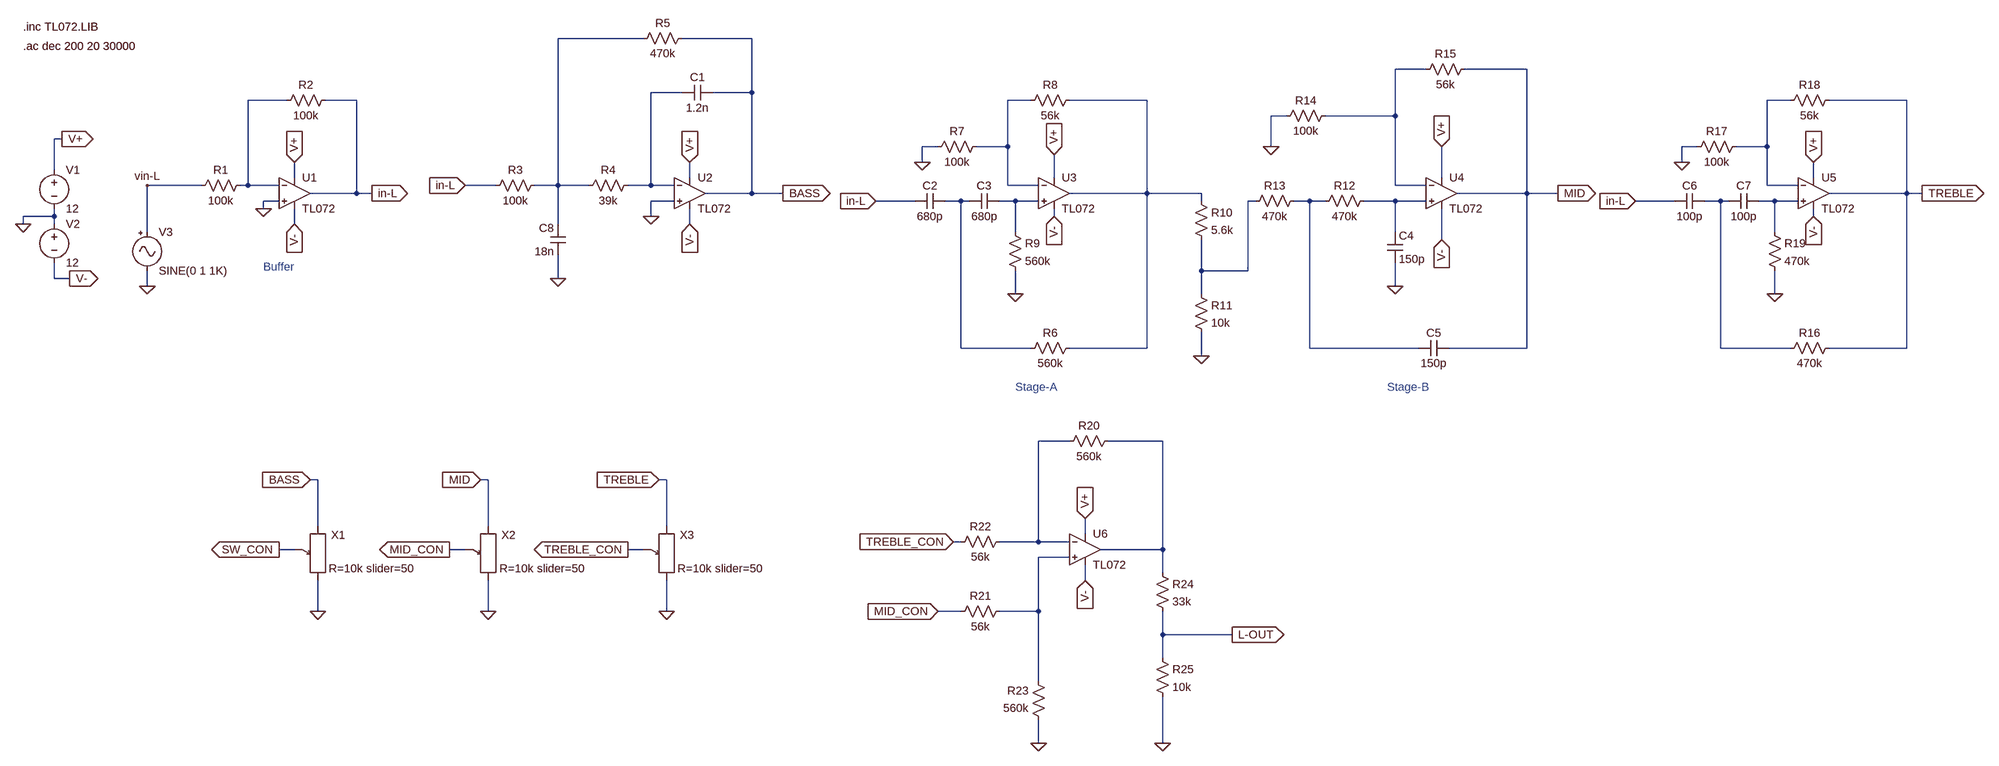
[diagram p0: schematic Audio-Preamplifier-LTSpice.asc]
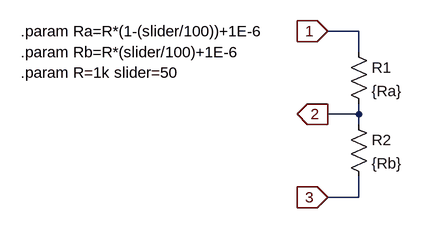
[diagram p1: sub-circuit potentiometer.asc]
Audio-Preamplifier-LTSpice.asc, the LTspice schematic file:
Version 4
SHEET 1 3604 1364
WIRE 816 -160 640 -160
WIRE 1040 -160 896 -160
WIRE 2432 -96 2368 -96
WIRE 2640 -96 2512 -96
WIRE 896 -48 832 -48
WIRE 1040 -48 1040 -160
WIRE 1040 -48 960 -48
WIRE 80 -32 0 -32
WIRE 224 -32 160 -32
WIRE 1616 -32 1568 -32
WIRE 1856 -32 1696 -32
WIRE 3184 -32 3136 -32
WIRE 3424 -32 3264 -32
WIRE 2144 0 2112 0
WIRE 2368 0 2368 -96
WIRE 2368 0 2224 0
WIRE -384 48 -400 48
WIRE 1424 64 1392 64
WIRE 1568 64 1568 -32
WIRE 1568 64 1504 64
WIRE 2112 64 2112 0
WIRE 2992 64 2960 64
WIRE 3136 64 3136 -32
WIRE 3136 64 3072 64
WIRE 1392 96 1392 64
WIRE 2960 96 2960 64
WIRE -400 112 -400 48
WIRE 96 128 96 96
WIRE 912 128 912 96
WIRE 1664 128 1664 80
WIRE 2464 128 2464 64
WIRE 3232 128 3232 96
WIRE -96 144 -208 144
WIRE 0 144 0 -32
WIRE 0 144 -16 144
WIRE 64 144 0 144
WIRE 512 144 448 144
WIRE 640 144 640 -160
WIRE 640 144 592 144
WIRE 704 144 640 144
WIRE 832 144 832 -48
WIRE 832 144 784 144
WIRE 880 144 832 144
WIRE 1568 144 1568 64
WIRE 1632 144 1568 144
WIRE 2368 144 2368 0
WIRE 2432 144 2368 144
WIRE 3136 144 3136 64
WIRE 3200 144 3136 144
WIRE 224 160 224 -32
WIRE 224 160 128 160
WIRE 256 160 224 160
WIRE 1040 160 1040 -48
WIRE 1040 160 944 160
WIRE 1104 160 1040 160
WIRE 1856 160 1856 -32
WIRE 1856 160 1696 160
WIRE 1968 160 1856 160
WIRE 2640 160 2640 -96
WIRE 2640 160 2496 160
WIRE 2704 160 2640 160
WIRE 3424 160 3424 -32
WIRE 3424 160 3264 160
WIRE 3456 160 3424 160
WIRE 64 176 32 176
WIRE 880 176 832 176
WIRE 1376 176 1296 176
WIRE 1472 176 1440 176
WIRE 1488 176 1472 176
WIRE 1584 176 1552 176
WIRE 1632 176 1584 176
WIRE 1968 176 1968 160
WIRE 2080 176 2064 176
WIRE 2192 176 2160 176
WIRE 2224 176 2192 176
WIRE 2368 176 2304 176
WIRE 2432 176 2368 176
WIRE 2944 176 2864 176
WIRE 3040 176 3008 176
WIRE 3056 176 3040 176
WIRE 3152 176 3120 176
WIRE 3200 176 3152 176
WIRE 32 192 32 176
WIRE -400 208 -400 192
WIRE -400 208 -464 208
WIRE 832 208 832 176
WIRE 1664 208 1664 192
WIRE 3232 208 3232 192
WIRE -464 224 -464 208
WIRE -400 224 -400 208
WIRE 96 224 96 192
WIRE 640 224 640 144
WIRE 912 224 912 192
WIRE -208 240 -208 144
WIRE 1584 240 1584 176
WIRE 2368 240 2368 176
WIRE 3152 240 3152 176
WIRE 2464 256 2464 192
WIRE 1968 320 1968 256
WIRE 2064 320 2064 176
WIRE 2064 320 1968 320
WIRE -400 336 -400 304
WIRE -368 336 -400 336
WIRE 640 336 640 288
WIRE -208 352 -208 320
WIRE 2368 352 2368 304
WIRE 1584 368 1584 320
WIRE 1968 368 1968 320
WIRE 3152 368 3152 320
WIRE 1472 480 1472 176
WIRE 1616 480 1472 480
WIRE 1856 480 1856 160
WIRE 1856 480 1696 480
WIRE 2192 480 2192 176
WIRE 2416 480 2192 480
WIRE 2640 480 2640 160
WIRE 2640 480 2480 480
WIRE 3040 480 3040 176
WIRE 3184 480 3040 480
WIRE 3424 480 3424 160
WIRE 3424 480 3264 480
WIRE 1968 496 1968 448
WIRE 1696 672 1632 672
WIRE 1888 672 1776 672
WIRE 144 752 128 752
WIRE 496 752 480 752
WIRE 864 752 848 752
WIRE 144 848 144 752
WIRE 496 848 496 752
WIRE 864 848 864 752
WIRE 1728 864 1728 832
WIRE 1472 880 1456 880
WIRE 1632 880 1632 672
WIRE 1632 880 1552 880
WIRE 1696 880 1632 880
WIRE 96 896 64 896
WIRE 448 896 416 896
WIRE 816 896 784 896
WIRE 1888 896 1888 672
WIRE 1888 896 1760 896
WIRE 1696 912 1632 912
WIRE 1888 944 1888 896
WIRE 1728 960 1728 928
WIRE 144 1024 144 960
WIRE 496 1024 496 960
WIRE 864 1024 864 960
WIRE 1472 1024 1424 1024
WIRE 1632 1024 1632 912
WIRE 1632 1024 1552 1024
WIRE 1888 1072 1888 1024
WIRE 2032 1072 1888 1072
WIRE 1888 1120 1888 1072
WIRE 1632 1168 1632 1024
WIRE 1632 1296 1632 1248
WIRE 1888 1296 1888 1200
FLAG -464 224 0
FLAG -384 48 V+
IOPIN -384 48 Out
FLAG -368 336 V-
IOPIN -368 336 Out
FLAG 32 192 0
FLAG -208 352 0
FLAG -208 144 vin-L
FLAG 256 160 in-L
IOPIN 256 160 Out
FLAG 832 208 0
FLAG 448 144 in-L
IOPIN 448 144 In
FLAG 2464 64 V+
IOPIN 2464 64 In
FLAG 2464 256 V-
IOPIN 2464 256 In
FLAG 1664 208 V-
IOPIN 1664 208 In
FLAG 1392 96 0
FLAG 1584 368 0
FLAG 1968 496 0
FLAG 2368 352 0
FLAG 2112 64 0
FLAG 1104 160 BASS
IOPIN 1104 160 Out
FLAG 2704 160 MID
IOPIN 2704 160 Out
FLAG 3232 208 V-
IOPIN 3232 208 In
FLAG 2960 96 0
FLAG 3152 368 0
FLAG 3456 160 TREBLE
IOPIN 3456 160 Out
FLAG 1664 80 V+
IOPIN 1664 80 In
FLAG 912 96 V+
IOPIN 912 96 In
FLAG 96 96 V+
IOPIN 96 96 In
FLAG 912 224 V-
IOPIN 912 224 In
FLAG 96 224 V-
IOPIN 96 224 In
FLAG 3232 96 V+
IOPIN 3232 96 In
FLAG 1728 832 V+
IOPIN 1728 832 In
FLAG 1728 960 V-
IOPIN 1728 960 In
FLAG 1632 1296 0
FLAG 128 752 BASS
IOPIN 128 752 In
FLAG 480 752 MID
IOPIN 480 752 In
FLAG 848 752 TREBLE
IOPIN 848 752 In
FLAG 144 1024 0
FLAG 496 1024 0
FLAG 864 1024 0
FLAG 64 896 SW_CON
IOPIN 64 896 Out
FLAG 416 896 MID_CON
IOPIN 416 896 Out
FLAG 784 896 TREBLE_CON
IOPIN 784 896 Out
FLAG 1456 880 TREBLE_CON
IOPIN 1456 880 In
FLAG 1424 1024 MID_CON
IOPIN 1424 1024 In
FLAG 2032 1072 L-OUT
IOPIN 2032 1072 Out
FLAG 1888 1296 0
FLAG 640 336 0
FLAG 1296 176 in-L
IOPIN 1296 176 In
FLAG 2864 176 in-L
IOPIN 2864 176 In
SYMBOL OpAmps\\opamp2 96 96 R0
SYMATTR InstName U1
SYMATTR Value TL072
SYMBOL voltage -400 96 R0
WINDOW 123 0 0 Left 0
WINDOW 39 0 0 Left 0
SYMATTR InstName V1
SYMATTR Value 12
SYMBOL voltage -400 208 R0
WINDOW 123 0 0 Left 0
WINDOW 39 0 0 Left 0
SYMATTR InstName V2
SYMATTR Value 12
SYMBOL res 0 128 R90
WINDOW 0 0 56 VBottom 2
WINDOW 3 32 56 VTop 2
SYMATTR InstName R1
SYMATTR Value 100k
SYMBOL res 176 -48 R90
WINDOW 0 0 56 VBottom 2
WINDOW 3 32 56 VTop 2
SYMATTR InstName R2
SYMATTR Value 100k
SYMBOL Misc\\signal -208 224 R0
WINDOW 39 0 0 Left 0
SYMATTR InstName V3
SYMATTR Value2 AC 1 0
SYMBOL OpAmps\\opamp2 912 96 R0
SYMATTR InstName U2
SYMATTR Value TL072
SYMBOL res 608 128 R90
WINDOW 0 0 56 VBottom 2
WINDOW 3 32 56 VTop 2
SYMATTR InstName R3
SYMATTR Value 100k
SYMBOL res 800 128 R90
WINDOW 0 0 56 VBottom 2
WINDOW 3 32 56 VTop 2
SYMATTR InstName R4
SYMATTR Value 39k
SYMBOL res 912 -176 R90
WINDOW 0 0 56 VBottom 2
WINDOW 3 32 56 VTop 2
SYMATTR InstName R5
SYMATTR Value 470k
SYMBOL cap 960 -64 R90
WINDOW 0 0 32 VBottom 2
WINDOW 3 32 32 VTop 2
SYMATTR InstName C1
SYMATTR Value 1.2n
SYMBOL OpAmps\\opamp2 1664 96 R0
SYMATTR InstName U3
SYMATTR Value TL072
SYMBOL OpAmps\\opamp2 2464 96 R0
SYMATTR InstName U4
SYMATTR Value TL072
SYMBOL cap 1440 160 R90
WINDOW 0 0 32 VBottom 2
WINDOW 3 32 32 VTop 2
SYMATTR InstName C2
SYMATTR Value 680p
SYMBOL cap 1552 160 R90
WINDOW 0 0 32 VBottom 2
WINDOW 3 32 32 VTop 2
SYMATTR InstName C3
SYMATTR Value 680p
SYMBOL res 1712 464 R90
WINDOW 0 0 56 VBottom 2
WINDOW 3 32 56 VTop 2
SYMATTR InstName R6
SYMATTR Value 560k
SYMBOL res 1520 48 R90
WINDOW 0 0 56 VBottom 2
WINDOW 3 32 56 VTop 2
SYMATTR InstName R7
SYMATTR Value 100k
SYMBOL res 1712 -48 R90
WINDOW 0 0 56 VBottom 2
WINDOW 3 32 56 VTop 2
SYMATTR InstName R8
SYMATTR Value 56k
SYMBOL res 1568 224 R0
SYMATTR InstName R9
SYMATTR Value 560k
SYMBOL res 1952 160 R0
SYMATTR InstName R10
SYMATTR Value 5.6k
SYMBOL res 1952 352 R0
SYMATTR InstName R11
SYMATTR Value 10k
SYMBOL res 2320 160 R90
WINDOW 0 0 56 VBottom 2
WINDOW 3 32 56 VTop 2
SYMATTR InstName R12
SYMATTR Value 470k
SYMBOL res 2176 160 R90
WINDOW 0 0 56 VBottom 2
WINDOW 3 32 56 VTop 2
SYMATTR InstName R13
SYMATTR Value 470k
SYMBOL res 2240 -16 R90
WINDOW 0 0 56 VBottom 2
WINDOW 3 32 56 VTop 2
SYMATTR InstName R14
SYMATTR Value 100k
SYMBOL res 2528 -112 R90
WINDOW 0 0 56 VBottom 2
WINDOW 3 32 56 VTop 2
SYMATTR InstName R15
SYMATTR Value 56k
SYMBOL cap 2352 240 R0
SYMATTR InstName C4
SYMATTR Value 150p
SYMBOL cap 2480 464 R90
WINDOW 0 0 32 VBottom 2
WINDOW 3 32 32 VTop 2
SYMATTR InstName C5
SYMATTR Value 150p
SYMBOL OpAmps\\opamp2 3232 96 R0
SYMATTR InstName U5
SYMATTR Value TL072
SYMBOL cap 3008 160 R90
WINDOW 0 0 32 VBottom 2
WINDOW 3 32 32 VTop 2
SYMATTR InstName C6
SYMATTR Value 100p
SYMBOL cap 3120 160 R90
WINDOW 0 0 32 VBottom 2
WINDOW 3 32 32 VTop 2
SYMATTR InstName C7
SYMATTR Value 100p
SYMBOL res 3280 464 R90
WINDOW 0 0 56 VBottom 2
WINDOW 3 32 56 VTop 2
SYMATTR InstName R16
SYMATTR Value 470k
SYMBOL res 3088 48 R90
WINDOW 0 0 56 VBottom 2
WINDOW 3 32 56 VTop 2
SYMATTR InstName R17
SYMATTR Value 100k
SYMBOL res 3280 -48 R90
WINDOW 0 0 56 VBottom 2
WINDOW 3 32 56 VTop 2
SYMATTR InstName R18
SYMATTR Value 56k
SYMBOL res 3136 224 R0
SYMATTR InstName R19
SYMATTR Value 470k
SYMBOL OpAmps\\opamp2 1728 832 R0
SYMATTR InstName U6
SYMATTR Value TL072
SYMBOL res 1792 656 R90
WINDOW 0 0 56 VBottom 2
WINDOW 3 32 56 VTop 2
SYMATTR InstName R20
SYMATTR Value 560k
SYMBOL res 1568 1008 R90
WINDOW 0 0 56 VBottom 2
WINDOW 3 32 56 VTop 2
SYMATTR InstName R21
SYMATTR Value 56k
SYMBOL res 1568 864 R90
WINDOW 0 0 56 VBottom 2
WINDOW 3 32 56 VTop 2
SYMATTR InstName R22
SYMATTR Value 56k
SYMBOL res 1648 1264 R180
WINDOW 0 36 76 Left 2
WINDOW 3 36 40 Left 2
SYMATTR InstName R23
SYMATTR Value 560k
SYMBOL potentiometer 144 880 R0
SYMATTR InstName X1
SYMATTR Value R=10k slider=50
SYMBOL potentiometer 496 880 R0
SYMATTR InstName X2
SYMATTR Value R=10k slider=50
SYMBOL potentiometer 864 880 R0
SYMATTR InstName X3
SYMATTR Value R=10k slider=50
SYMBOL res 1872 928 R0
SYMATTR InstName R24
SYMATTR Value 33k
SYMBOL res 1872 1104 R0
SYMATTR InstName R25
SYMATTR Value 10k
SYMBOL cap 656 288 R180
WINDOW 0 24 56 Left 2
WINDOW 3 24 8 Left 2
SYMATTR InstName C8
SYMATTR Value 18n
TEXT -464 -184 Left 2 !.inc TL072.LIB
TEXT -464 -144 Left 2 !.ac dec 200 20 30000
TEXT 32 312 Left 2 ;Buffer
TEXT 1584 560 Left 2 ;Stage-A
TEXT 2352 560 Left 2 ;Stage-B

potentiometer.asc, the sub-circuit schematic file:
Version 4
SHEET 1 880 680
WIRE 128 32 80 32
WIRE 128 64 128 32
WIRE 128 160 128 144
WIRE 128 160 80 160
WIRE 128 176 128 160
WIRE 128 288 128 256
WIRE 128 288 80 288
FLAG 80 32 1
IOPIN 80 32 In
FLAG 80 160 2
IOPIN 80 160 Out
FLAG 80 288 3
IOPIN 80 288 In
SYMBOL res 112 48 R0
SYMATTR InstName R1
SYMATTR Value {Ra}
SYMBOL res 112 160 R0
SYMATTR InstName R2
SYMATTR Value {Rb}
TEXT -392 32 Left 2 !.param Ra=R*(1-(slider/100))+1E-6
TEXT -392 64 Left 2 !.param Rb=R*(slider/100)+1E-6
TEXT -392 96 Left 2 !.param R=1k slider=50

The netlist it stands for:
* Audio-Preamplifier-LTSpice.asc
XU1 0 N004 V+ V- in-L TL072  ; pins In+ In- V+ V- OUT
V1 V+ 0 12
V2 0 V- 12
R1 N004 vin-L 100k
R2 in-L N004 100k
V3 vin-L 0 SINE(0 1 1K) AC 1 0
XU2 0 N003 V+ V- BASS TL072  ; pins In+ In- V+ V- OUT
R3 N001 in-L 100k
R4 N003 N001 39k
R5 BASS N001 470k
C1 BASS N003 1.2n
XU3 N009 N005 V+ V- N006 TL072  ; pins In+ In- V+ V- OUT
XU4 N012 N002 V+ V- MID TL072  ; pins In+ In- V+ V- OUT
C2 N008 in-L 680p
C3 N009 N008 680p
R6 N006 N008 560k
R7 N005 0 100k
R8 N006 N005 56k
R9 N009 0 560k
R10 N006 N010 5.6k
R11 N010 0 10k
R12 N012 N011 470k
R13 N011 N010 470k
R14 N002 0 100k
R15 MID N002 56k
C4 N012 0 150p
C5 MID N011 150p
XU5 N014 N007 V+ V- TREBLE TL072  ; pins In+ In- V+ V- OUT
C6 N013 in-L 100p
C7 N014 N013 100p
R16 TREBLE N013 470k
R17 N007 0 100k
R18 TREBLE N007 56k
R19 N014 0 470k
XU6 N017 N015 V+ V- N016 TL072  ; pins In+ In- V+ V- OUT
R20 N016 N015 560k
R21 N017 MID_CON 56k
R22 N015 TREBLE_CON 56k
R23 0 N017 560k
XX1 BASS SW_CON 0 potentiometer params: R=10k slider=50
XX2 MID MID_CON 0 potentiometer params: R=10k slider=50
XX3 TREBLE TREBLE_CON 0 potentiometer params: R=10k slider=50
R24 N016 L-OUT 33k
R25 L-OUT 0 10k
C8 0 N001 18n

* block symbol definitions
.subckt potentiometer 1 2 3
R1 1 2 {Ra}
R2 2 3 {Rb}
.param Ra=R*(1-(slider/100))+1E-6
.param Rb=R*(slider/100)+1E-6
.param R=1k slider=50
.ends potentiometer

.inc TL072.LIB
.ac dec 200 20 30000
* Buffer
* Stage-A
* Stage-B
.backanno
.end